# Altium schematic sheet Analog.SchDoc
size A
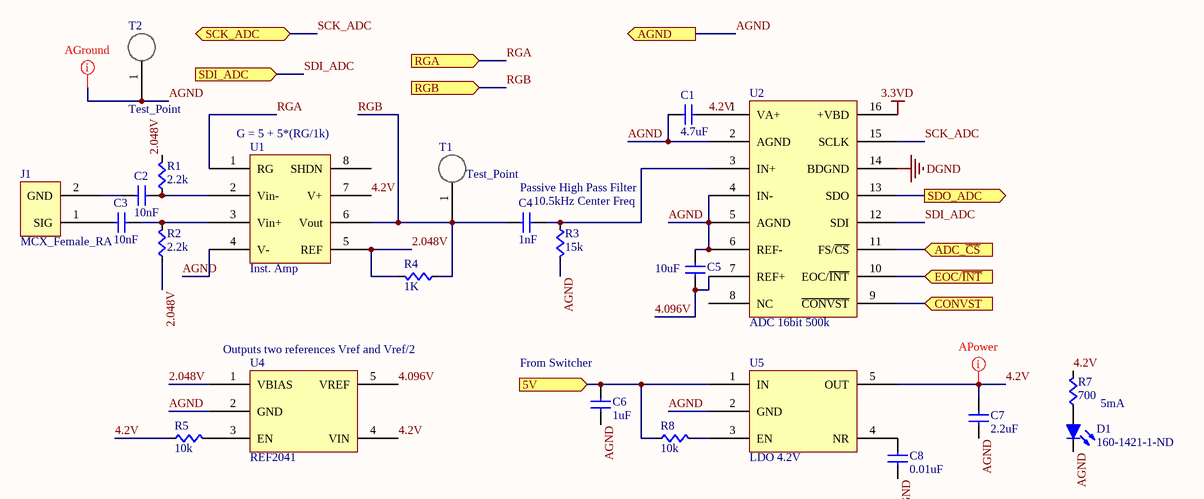
[diagram p0: Analog.SchDoc]

## Parts
C1  value 4.7uF  [CAPC0603]  (hidden comment: Cap)
C2  value 10nF  [CAPC0603]  (hidden comment: Cap)
C3  value 10nF  [CAPC0603]  (hidden comment: Cap)
C4  value 1nF  [CAPC0603]  (hidden comment: Cap)
C5  value 10uF  [CAPC0603]  (hidden comment: Cap)
C6  value 1uF  [CAPC0603]  (hidden comment: Cap)
C7  value 2.2uF  [CAPC0603]  (hidden comment: Cap)
C8  value 0.01uF  [CAPC0603]  (hidden comment: Cap)
D1  Supplier Part Number: 160-1421-1-ND  [LED0805-RED]  (hidden comment: LED-RED)
J1  MCX_Female_RA  [MCX_Female]
R1  value 2.2k  [RES0603]  (hidden comment: Res)
R2  value 2.2k  [RES0603]  (hidden comment: Res)
R3  value 15k  [RES0603]  (hidden comment: Res)
R4  value 1K  [RES0603]  (hidden comment: Res)
R5  value 10k  [RES0603]  (hidden comment: Res)
R7  value 700  [RES0603]  (hidden comment: Res)
R8  value 10k  [RES0603]  (hidden comment: Res)
T1  Test_Point  [TP]
T2  Test_Point  [TP]
U1  Inst. Amp  [TSSOP-8n]
U2  ADC 16bit 500k  [TSSOP-16pin]
U4  REF2041  [SOT23-5]
U5  LDO 4.2V  [sot23-5]

## Ports
5V (in), ADC_~{CS} (in), AGND (out), CONVST (in), EOC/~{INT} (in), RGA (in), RGB (in), SCK_ADC (bidir), SDI_ADC (in), SDO_ADC (out)

## Nets
3.3VD: U2.16(+VBD)
DGND: U2.14(BDGND)
2.048V: R1.1(A) R2.2(B) R4.1(A) U1.5(REF) U4.1(VBIAS)
4.2V: C1.2(B) C7.2(B) R5.2(B) R7.1(A) U1.7(V+) U2.1(VA+) U4.4(VIN) U5.5(OUT)
4.096V: C5.2(B) U2.7(REF+) U4.5(VREF)
5V: C6.2(B) R8.2(B) U5.1(IN) ; port 5V
ADC_~{CS}: U2.11(FS/~{CS}) ; port ADC_~{CS}
AGND: C1.1(A) C5.1(A) C6.1(A) C7.1(A) C8.1(A) D1.1(K) R3.1(A) T2.1 U1.4(V-) U2.2(AGND) U2.4(IN-) U2.5(AGND) U2.6(REF-) U4.2(GND) U5.2(GND) ; port AGND
CONVST: U2.9(~{CONVST}) ; port CONVST
EOC/~{INT}: U2.10(EOC/~{INT}) ; port EOC/~{INT}
RGA: U1.1(RG) ; port RGA
RGB: C4.1(A) R4.2(B) T1.1 U1.6(Vout) ; port RGB
SCK_ADC: U2.15(SCLK) ; port SCK_ADC
SDI_ADC: U2.12(SDI) ; port SDI_ADC
SDO_ADC: U2.13(SDO) ; port SDO_ADC
NetC2_1: C2.1(A) J1.2(GND)
NetC2_2: C2.2(B) R1.2(B) U1.2(Vin-)
NetC3_1: C3.1(A) J1.1(SIG)
NetC3_2: C3.2(B) R2.1(A) U1.3(Vin+)
NetC4_2: C4.2(B) R3.2(B) U2.3(IN+)
NetC8_2: C8.2(B) U5.4(NR)
NetD1_2: D1.2(A) R7.2(B)
NetR5_1: R5.1(A) U4.3(EN)
NetR8_1: R8.1(A) U5.3(EN)

Not connected (* = marked no-connect by the designer): U1 8(SHDN); U2 8(NC)

## Layout directives
net class AGround: AGND
net class APower: 4.2V

## Notes on the sheet
- (near U1) G = 5 + 5*(RG/1k)
- Passive High Pass Filter
- 10.5kHz Center Freq
- (near U4) Outputs two references Vref and Vref/2
- (near C6) From Switcher
- 5mA

## Library data of the parts
D1 = LED-RED: Light Emitting Diode - RED; Manufacturer Part Number: LTST-C171CKT; Manufacturer: Lite-On Inc; Voltage - Forward (Vf) Typ: 1.8V; Current - Test: 20mA; Millicandela Rating: 25mcd; Viewing Angle: 130°; Color: Red; Supplier: Digi-Key; Package / Case: 0805 (2012 Metric)
J1 = MCX_Female_RA: CONN MCX JACK R/A 50 OHM PCB; Supplier 1: Digi-Key; Supplier Part Number 1: A98546-ND
T1 T2 = Test_Point: TEST POINT PC COMPACT .063"D; Supplier 1: Digi-Key; Supplier Part Number 1: 5006K-ND
U1 = INA331: IC OPAMP INSTR 2MHZ RRO 8VSSOP; Suplier Part Number 1: 296-12202-1-ND; Supplier 1: Digi-Key
U2 = ADC 16bit 500k: IC ADC 16BIT 500KSPS 16-TSSOP; Supplier 1: Digi-Key; Supplier Part Number 1: 296-19764-ND
U4 = REF2041: IC VREF SERIES 2.05V/4.096V 5SOT; Supplier 1: Digi-Key; Supplier Part Number 1: 296-38497-1-ND
U5 = LDO 4.2V 200mA: IC REG LDO 4.2V 0.2A 5SOT; Supplier 1: Digi-Key; Supplier Part Number 1: 296-32585-1-ND
C1-C8 = Cap: Supplier 1: Digi-Key; Supplier Part Number 1: 1276-1000-1-ND
R1-R5 R7 R8 = Res: Supplier 1: Digi-Key; Supplier Part Number 1: RMCF0603JT10K0CT-ND